# EAGLE design T17_Schematic_The_Useless_Box (EAGLE 7.1.0)
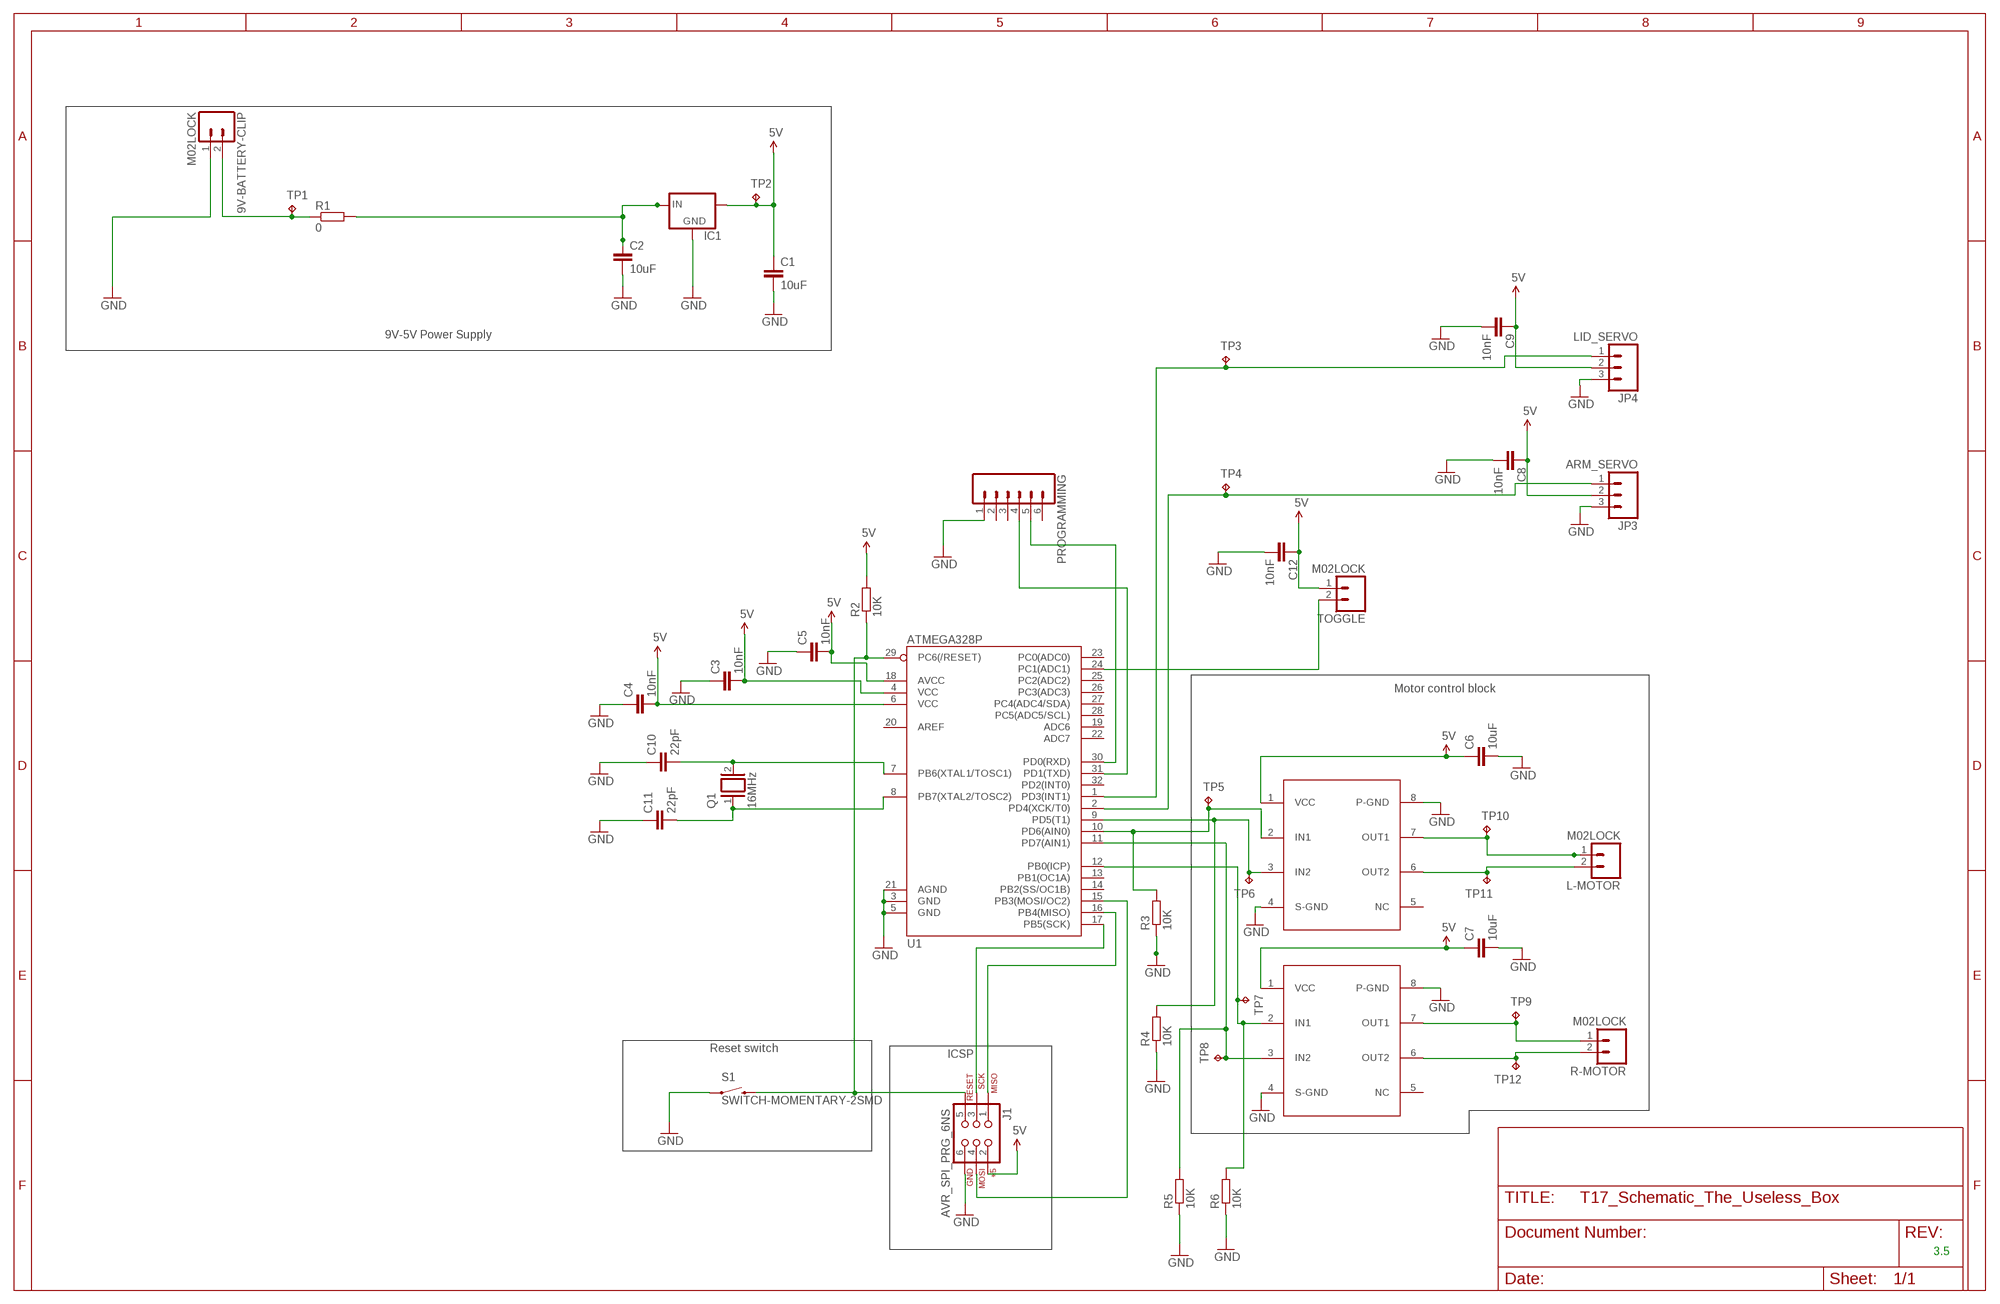
[diagram p0: schematic, sheet 1]

## Parts
9V-BATTERY-CLIP  M02LOCK  [1X02_LOCK]
C1  10uF  C-EUC0805  [C0805]
C2  10uF  C-EUC0805  [C0805]
C3  10nF  C-EUC0805  [C0805]
C4  10nF  C-EUC0805  [C0805]
C5  10nF  C-EUC0805  [C0805]
C6  10uF  C-EUC0805  [C0805]
C7  10uF  C-EUC0805  [C0805]
C8  10nF  C-EUC0805  [C0805]
C9  10nF  C-EUC0805  [C0805]
C10  22pF  C-EUC0805  [C0805]
C11  22pF  C-EUC0805  [C0805]
C12  10nF  C-EUC0805  [C0805]
IC1  V_REG_78XX-TO-220  [TO-220-ALT]
J1  AVR_SPI_PRG_6NS  [2X3-NS]
JP3  ARM_SERVO  M03PTH  [1X03]
JP4  LID_SERVO  M03PTH  [1X03]
L-MOTOR  M02LOCK  [1X02_LOCK]
PROGRAMMING  M06NO_SILK_FEMALE_PTH  [1X06_NO_SILK]
Q1  16MHz  XTAL/S  [QS]
R1  0  R-EU_R0805  [R0805]
R2  10K  R-EU_R0805  [R0805]
R3  10K  R-EU_R0805  [R0805]
R4  10K  R-EU_R0805  [R0805]
R5  10K  R-EU_R0805  [R0805]
R6  10K  R-EU_R0805  [R0805]
R-MOTOR  M02LOCK  [1X02_LOCK]
S1  SWITCH-MOMENTARY-2SMD  [TACTILE-SWITCH-SMD]
TOGGLE  M02LOCK  [1X02_LOCK]
TP1  TPB1,27  [B1,27]
TP2  TPB1,27  [B1,27]
TP3  TPB1,27  [B1,27]
TP4  TPB1,27  [B1,27]
TP5  TPB1,27  [B1,27]
TP6  TPB1,27  [B1,27]
TP7  TPB1,27  [B1,27]
TP8  TPB1,27  [B1,27]
TP9  TPB1,27  [B1,27]
TP10  TPB1,27  [B1,27]
TP11  TPB1,27  [B1,27]
TP12  TPB1,27  [B1,27]
U1  ATMEGA328P  ATMEGA328_SMT  [TQFP32-08]
U$1  LB1938FA-AH  [MSOP8]
U$2  LB1938FA-AH  [MSOP8]

## Nets
5V: C1.1 C3.2 C4.2 C5.2 C6.1 C7.1 C8.1 C9.1 C12.1 IC1.OUT J1.2 JP3.2 JP4.2 R2.2 TOGGLE.1 TP2.TP U1.4(VCC) U1.6(VCC) U1.18(AVCC) U$1.1(VCC) U$2.1(VCC)
GND: 9V-BATTERY-CLIP.1 C1.2 C2.2 C3.1 C4.1 C5.1 C6.2 C7.2 C8.2 C9.2 C10.1 C11.1 C12.2 IC1.GND J1.6 JP3.3 JP4.3 PROGRAMMING.1 R3.1 R4.1 R5.1 R6.1 S1.1 U1.3(GND) U1.5(GND) U1.21(AGND) U$1.4(S-GND) U$1.8(P-GND) U$2.4(S-GND) U$2.8(P-GND)
N$1: R6.2 TP7.TP U1.12(PB0(ICP)) U$1.2(IN1)
N$2: R-MOTOR.1 TP9.TP U$1.7(OUT1)
N$3: R-MOTOR.2 TP12.TP U$1.6(OUT2)
N$4: L-MOTOR.2 TP11.TP U$2.6(OUT2)
N$5: L-MOTOR.1 TP10.TP U$2.7(OUT1)
N$6: R5.2 TP8.TP U1.11(PD7(AIN1)) U$1.3(IN2)
N$7: J1.4 U1.15(PB3(MOSI/OC2))
N$8: JP3.1 TP4.TP U1.2(PD4(XCK/T0))
N$9: PROGRAMMING.5 U1.30(PD0(RXD))
N$10: JP4.1 TP3.TP U1.1(PD3(INT1))
N$11: C2.1 IC1.IN R1.2
N$12: 9V-BATTERY-CLIP.2 R1.1 TP1.TP
N$13: R3.2 TP5.TP U1.10(PD6(AIN0)) U$2.2(IN1)
N$14: J1.3 U1.17(PB5(SCK))
N$15: PROGRAMMING.4 U1.31(PD1(TXD))
N$16: J1.5 R2.1 S1.3 U1.29(PC6(/RESET))
N$17: C11.2 Q1.1 U1.8(PB7(XTAL2/TOSC2))
N$18: J1.1 U1.16(PB4(MISO))
N$19: C10.2 Q1.2 U1.7(PB6(XTAL1/TOSC1))
N$20: R4.2 TP6.TP U1.9(PD5(T1)) U$2.3(IN2)
N$21: TOGGLE.2 U1.24(PC1(ADC1))
Unconnected: PROGRAMMING.2 PROGRAMMING.3 PROGRAMMING.6 U1.13(PB1(OC1A)) U1.14(PB2(SS/OC1B)) U1.19(ADC6) U1.20(AREF) U1.22(ADC7) U1.23(PC0(ADC0)) U1.25(PC2(ADC2)) U1.26(PC3(ADC3)) U1.27(PC4(ADC4/SDA)) U1.28(PC5(ADC5/SCL)) U1.32(PD2(INT0)) U$1.5(NC) U$2.5(NC)

## Notes on the sheet
- 9V-5V Power Supply
- Motor control block
- Reset switch
- ICSP
- 3.5

## Library data of the parts
9V-BATTERY-CLIP L-MOTOR R-MOTOR TOGGLE = SparkFun-Connectors:M02: Standard 2-pin 0.1" header. Use with - straight break away headers ( PRT-00116) - right angle break away headers (PRT-00553) - swiss pins (PRT-00743) - machine pins (PRT-00117) - female headers (PRT-00115) Molex polarized connector foot print use with: PRT-08233 with associated crimp pins and housings. 2.54_SCREWTERM for use with PRT-10571. 3.5mm Screw Terminal footprints for PRT-08084 5mm Screw Terminal footprints for use with PRT-08432
C1-C12 = rcl:C-EU: CAPACITOR, European symbol
IC1 = SparkFun-PowerIC:V_REG_78XX: Voltage Regulator Standard 7805 5V regulator. IGO (Input Ground Output). Spark Fun Electronics SKU : COM-00107
J1 = SparkFun-Connectors:AVR_SPI_PRG_6: AVR ISP 6 Pin This is the reduced ISP connector for AVR programming. Common on Arduino. This footprint will take up less PCB space and can be used with a 10-pin to 6-pin adapter such as SKU: BOB-08508 **Special note about "TEST_POINT" package. The stop mask is on the top side, so if you want your programming test points to be on the bottom of your board, make sure to place this package on the bottom side of the board. This also ensure that the orientation to program from the bottom side will be correct.
JP3 JP4 = SparkFun-Connectors:M03: Header 3 Standard 3-pin 0.1" header. Use with straight break away headers (SKU : PRT-00116), right angle break away headers (PRT-00553), swiss pins (PRT-00743), machine pins (PRT-00117), and female headers (PRT-00115). Molex polarized connector foot print use with SKU : PRT-08232 with associated crimp pins and housings.
PROGRAMMING = SparkFun-Connectors:M06: Header 6 Standard 6-pin 0.1" header. Use with straight break away headers (SKU : PRT-00116), right angle break away headers (PRT-00553), swiss pins (PRT-00743), machine pins (PRT-00117), and female headers (PRT-00115). Molex polarized connector foot print use with SKU : PRT-08094 with associated crimp pins and housings. NOTES ON THE VARIANTS LOCK and LOCK_LONGPADS... This footprint was designed to help hold the alignment of a through-hole component (i.e. 6-pin header) while soldering it into place. You may notice that each hole has been shifted either up or down by 0.005 of an inch from it's more standard position (which is a perfectly straight line). This slight alteration caused the pins (the squares in the middle) to touch the edges of the holes. Because they are alternating, it causes a "brace" to hold the component in place. 0.005 has proven to be the perfect amount of "off-center" position when using our standard breakaway headers. Although looks a little odd when you look at the bare footprint, once you have a header in there, the alteration is very hard to notice. Also,if you push a header all the way into place, it is covered up entirely on the bottom side. This idea of altering the position of holes to aid alignment will be further integrated into the Sparkfun Library for other footprints. It can help hold any component with 3 or more connection pins.; PROD_ID: CONN-08437
Q1 = special:XTAL/S: CRYSTAL
R1-R6 = rcl:R-EU_: RESISTOR, European symbol
S1 = SparkFun-Electromechanical:SWITCH-MOMENTARY-2: Various NO switches- pushbuttons, reed, etc; PROD_ID: SWCH-08247
TP1-TP12 = testpad:TP: Test pad
U1 = SparkFun-DigitalIC:ATMEGA328_SMT: 32-Pin Atmega328 part Commonly used on Arduino compatible boards Available in QFP and QFN packages TQFP is IC-09069 QFN is non-stock; PROD_ID: IC-09069
U$1 U$2 = microchip-MCP125x-xxx:LB1938FA-AH

## Board
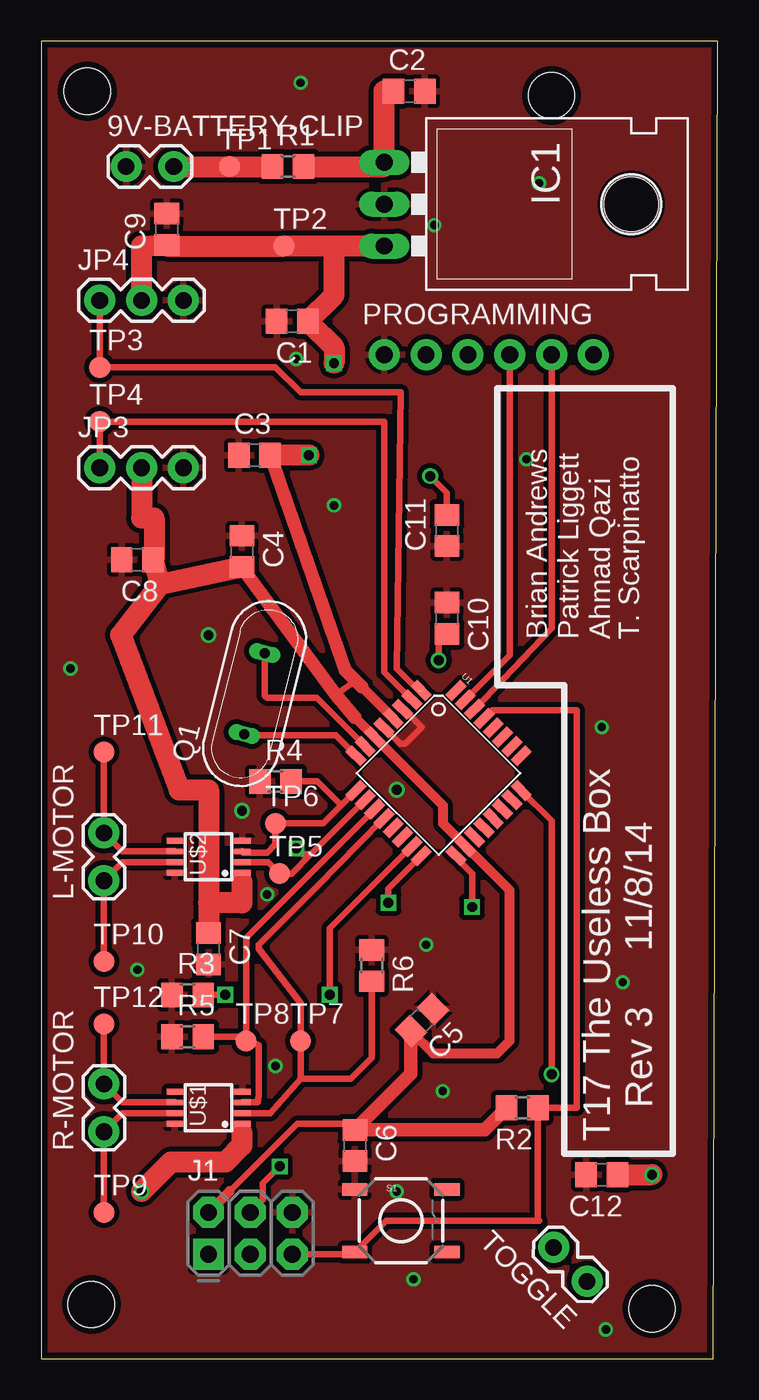
[diagram p1: board, top side]
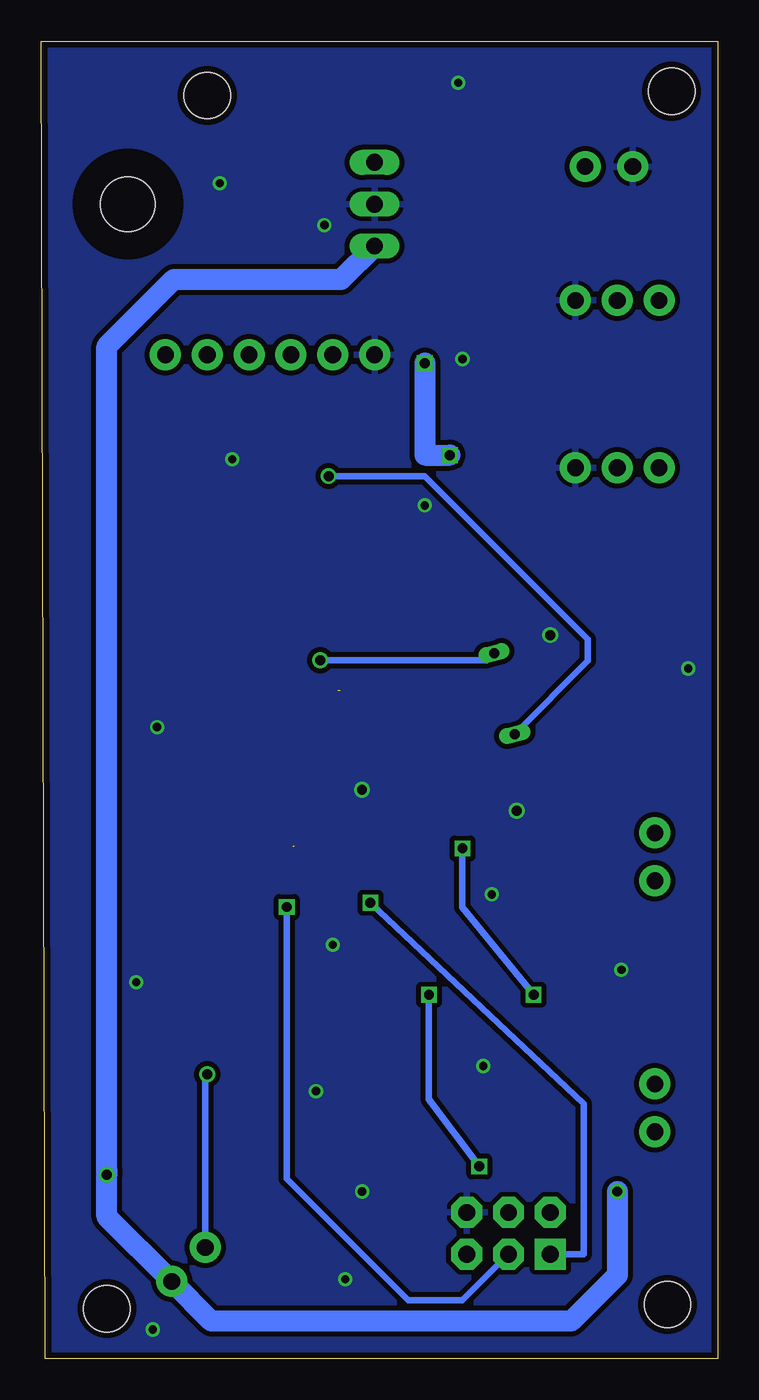
[diagram p2: board, bottom side, seen from below]

Size 41.07 x 80 mm. Coordinates in mm from the lower left corner, seen from the top.
Outline: 0,0 40.82,0 41.07,80 0,80 0,0
Copper layers (1*16): Top 0.0356mm / dielectric 1.5011mm / Bottom 0.0356mm
Design rules "OSH-Park-2-layer": minimum track width 6mil, minimum drill 13mil, track to track 6mil, track to pad 6mil, pad to pad 6mil, via to via 6mil, smd to smd 6mil, copper to edge 15mil, drill to drill 6mil, minimum pad ring 7mil, minimum via ring 7mil, stop-mask expansion 3mil, vias tented up to drill 0mil, thermal gap 10mil
Holes 2.8 mm at 2.79,76.96 30.99,76.71 37.08,3.05 3.05,3.3

### Footprints (pad centres in the part's own frame; a part is rotated, then mirrored left to right if it is on the bottom)
1X02_LOCK = drill 1.016 pad 1.88: 1 -0.178,0; 2 2.718,0
C0805 = smd 1.3 x 1.5: 1 -0.95,0; 2 0.95,0
TO-220-ALT = drill 1.016 long: GND 0,-3.81; IN -2.54,-3.81; OUT 2.54,-3.81 | hole 3.302: 0,11.176
2X3-NS = drill 1.016 pad 1.88 square: 1 -2.54,-1.27 | drill 1.016 pad 1.88 octagon: 2 -2.54,1.27; 3 0,-1.27; 4 0,1.27; 5 2.54,-1.27; 6 2.54,1.27
1X03 = drill 1.016 pad 1.88: 1 0,0; 2 2.54,0; 3 5.08,0
1X06_NO_SILK = drill 1.016 pad 1.88: 1 0,0; 2 2.54,0; 3 5.08,0; 4 7.62,0; 5 10.16,0; 6 12.7,0
QS = drill 0.61 long: 1 -2.54,0; 2 2.54,0
R0805 = smd 1.3 x 1.5: 1 -0.95,0; 2 0.95,0
TACTILE-SWITCH-SMD = smd 1.524 x 0.762: 1 -2.794,1.905; 2 2.794,1.905; 3 -2.794,-1.905; 4 2.794,-1.905
B1,27 = smd 1.27 x 1.27: TP 0,0
TQFP32-08 = smd 1.27 x 0.559: 1 -4.293,2.8; 2 -4.293,2; 3 -4.293,1.2; 4 -4.293,0.4; 5 -4.293,-0.4; 6 -4.293,-1.2; 7 -4.293,-2; 8 -4.293,-2.8; 17 4.293,-2.8; 18 4.293,-2; 19 4.293,-1.2; 20 4.293,-0.4; 21 4.293,0.4; 22 4.293,1.2; 23 4.293,2; 24 4.293,2.8 | smd 0.559 x 1.27: 9 -2.8,-4.293; 10 -2,-4.293; 11 -1.2,-4.293; 12 -0.4,-4.293; 13 0.4,-4.293; 14 1.2,-4.293; 15 2,-4.293; 16 2.8,-4.293; 25 2.8,4.293; 26 2,4.293; 27 1.2,4.293; 28 0.4,4.293; 29 -0.4,4.293; 30 -1.2,4.293; 31 -2,4.293; 32 -2.8,4.293
MSOP8 = smd 0.35 x 1: 1 -0.975,-2.05; 2 -0.325,-2.05; 3 0.325,-2.05; 4 0.975,-2.05; 5 0.975,2.05; 6 0.325,2.05; 7 -0.325,2.05; 8 -0.975,2.05

### Placement (x,y rotation side)
9V-BATTERY-CLIP  5.33,72.39 0 top
C1  15.24,62.99 180 top
C2  22.35,76.96 0 top
C3  12.95,54.86 0 top
C4  12.19,49.02 270 top
C5  23.11,20.57 225 top
C6  19.05,12.95 270 top
C7  10.16,24.89 270 top
C8  5.84,48.51 180 top
C9  7.62,68.58 90 top
C10  24.64,44.96 270 top
C11  24.64,50.29 90 top
C12  34.04,11.18 180 top
IC1  24.64,70.1 270 top
J1  12.7,7.62 0 top
JP3  3.56,54.1 0 top
JP4  3.56,64.26 0 top
L-MOTOR  3.81,29.21 90 top
PROGRAMMING  20.83,60.96 0 top
Q1  12.95,40.39 75.8 top
R1  14.99,72.39 0 top
R2  29.21,15.24 180 top
R3  8.89,22.1 0 top
R4  14.22,35.05 0 top
R5  8.89,19.56 0 top
R6  20.07,23.88 270 top
R-MOTOR  3.81,13.97 90 top
S1  21.84,8.38 0 top
TOGGLE  33.02,4.83 134.6 top
TP1  11.43,72.39 0 top
TP2  14.73,67.56 0 top
TP3  3.56,60.2 0 top
TP4  3.56,56.9 0 top
TP5  14.48,29.46 0 top
TP6  14.22,32.51 0 top
TP7  15.75,19.3 0 top
TP8  12.45,19.3 0 top
TP9  3.81,8.89 0 top
TP10  3.81,24.13 0 top
TP11  3.81,36.83 0 top
TP12  3.81,20.32 0 top
U1  24.13,35.56 315 top
U$1  10.16,15.24 90 top
U$2  10.16,30.48 90 top

### Tracks (layer width: path | path; a pad name or v marks a point on that pad's centre or on a via)
5V  (via drill 0.6, 0.6 pad 0.25)  (2 unrouted)
  Top 0.406: C6.1 19.05,14.27 15.54,14.27 11.45,10.18 | U1.4 19.05,41.15 17.9,40.31 | U$1.1 12.21,13.73 12.19,13.72 | U$2.1 12.21,28.97 12.19,28.96
  Top 0.61: U1.4 19.46,40.8 | 19.04,38.95 U1.6 24.38,33.61 24.38,32.51 25.75,31.14 | 11.45,10.18 J1.2 | C5.2 23.8,18.54 27.69,18.54 28.45,19.3 28.45,28.45 25.79,31.11
  Top 0.813: 19.46,40.8 18.45,41.8 C3.2 | 19.04,38.95 17.9,40.31 C4.2 | R2.2 26.92,13.9 C6.1 22.44,17.3 C5.2
  Top 1.27: 10.16,27.69 10.16,34.54 8.38,34.54 4.83,43.94 7.19,46.99 | 10.16,27.69 C7.1 | C4.2 7.19,46.99 | 7.19,46.99 C8.1 6.86,48.51 6.86,51.05 6.1,51.05 JP3.2 | IC1.OUT 17.78,67.56 | 17.78,67.56 TP2.TP 7.62,67.56 C9.1 6.1,67.56 JP4.2 | v17.78,60.45 17.78,61.4 C1.1 17.78,64.58 17.78,67.56 | v16.26,54.86 C3.2 | 12.19,13.72 12.19,12.95 11.18,11.94 7.87,11.94 v6.1,10.16 | 12.19,28.96 12.19,27.69 10.16,27.69 | C12.1 v37.08,11.18
  Bottom 1.27: v17.78,60.45 17.78,54.86 v16.26,54.86 | v6.1,10.16 6.1,5.08 8.89,2.29 30.73,2.29 TOGGLE.1 | IC1.OUT 22.86,65.53 33.02,65.53 37.08,61.47 37.08,11.43 v37.08,11.18 37.08,8.64 TOGGLE.1 | TOGGLE.1 | TOGGLE.1
GND  (via drill 0.5, 0.6, 0.6 pad 0.25)
  Top 0.406: U1.5 21.79,37.34 22.1,37.34 23.11,38.35 22.02,39.44 U1.3
  other vias: 34.29,1.78 21.59,10.16 22.61,4.83 24.38,16.26 35.31,22.86 23.37,25.15 5.84,23.62 34.04,38.35 1.78,41.91 17.78,51.82 29.46,54.61 23.88,68.83 30.23,71.37 15.75,77.47 15.49,60.71 12.19,33.27 10.16,43.94 21.59,34.54 14.22,17.78 13.72,28.19
  pour Top (isolate 0.305): 0,80.01 40.89,80.01 40.89,0 0,0
  pour Bottom (isolate 0.305): 0,0 0,80.01 40.89,80.01 40.89,0
N$1
  Top 0.406: U1.12 19.3,31.3 16.76,28.7 13.21,25.15 13.21,24.89 15.75,21.59 TP7.TP 15.75,17.02 | U$1.2 13.9,14.91 15.75,17.02 | R6.2 20.07,18.29 18.8,17.02 15.75,17.02
N$2
  Top 0.406: U$1.7 4.93,14.91 R-MOTOR.1 TP9.TP
N$3
  Top 0.406: U$1.6 4.93,15.56 R-MOTOR.2 TP12.TP
N$4
  Top 0.406: U$2.6 4.93,30.8 L-MOTOR.2 TP11.TP
N$5
  Top 0.406: TP10.TP L-MOTOR.1 4.93,30.16 U$2.7
N$6
  Top 0.406: U1.11 12.45,25.57 TP8.TP | TP8.TP 13.21,19.05 13.21,16 13.14,15.56 U$1.3 | R5.2 12.19,19.56 TP8.TP
N$7  (via drill 0.6)
  Top 0.406: U1.15 17.53,26.13 v17.53,22.1 | v14.48,11.68 13.46,10.67 13.46,9.65 J1.4
  Bottom 0.406: v17.53,22.1 17.53,15.75 v14.48,11.68
N$8
  Top 0.406: U1.2 20.83,41.69 20.83,56.9 TP4.TP JP3.1
N$9
  Top 0.406: U1.30 30.99,44.37 PROGRAMMING.5
N$10  (1 unrouted)
  Top 0.406: 22.93,40.58 21.59,41.91 21.84,58.67 15.75,58.67 14.22,60.2 TP3.TP JP4.1
N$11
  Top 1.27: R1.2 20.83,72.39 IC1.IN 20.83,76.96 C2.1
N$12
  Top 1.27: 9V-BATTERY-CLIP.2 TP1.TP R1.1
N$13  (via drill 0.6)
  Top 0.406: U$2.2 13.79,30.16 TP5.TP 15.21,29.46 16.37,30.62 | U1.10 16.37,30.62 | R3.2 v11.18,22.1 | v15.49,30.99 15.86,30.62 16.37,30.62
  Bottom 0.406: v11.18,22.1 15.49,27.43 v15.49,30.99
N$14  (via drill 0.6)
  Top 0.406: v26.16,27.43 26.16,29.46 25.18,30.44 U1.17
  Bottom 0.406: v26.16,27.43 26.16,10.92 18.8,3.56 15.49,3.56 J1.3
N$15
  Top 0.406: U1.31 28.45,42.71 PROGRAMMING.4
N$16
  Top 0.406: U1.29 27.37,39.37 32.51,39.37 32.51,15.24 R2.1 30.16,8.45 30.23,8.38 20.95,8.38 S1.3 18.92,6.35 J1.5
N$17  (via drill 0.6 pad 0.25)
  Top 0.406: U1.8 17.88,37.85 12.41,37.85 Q1.1 | C11.2 24.64,52.58 v23.62,53.59
  Bottom 0.406: v23.62,53.59 17.78,53.59 7.87,43.69 7.87,42.38 Q1.1
N$18  (via drill 0.6)
  Top 0.406: U1.16 21.08,28.55 v21.08,27.69
  Bottom 0.406: v21.08,27.69 8.13,15.49 8.13,6.35 J1.1
N$19  (via drill 0.6 pad 0.25)
  Top 0.406: U1.7 16.73,40.13 13.72,40.13 13.58,40.27 Q1.2 | C10.2 24.13,43.5 v24.13,42.42
  Bottom 0.406: v24.13,42.42 14.01,42.42 Q1.2
N$20
  Top 0.406: U1.9 18.21,33.6 | 18.21,33.6 17.12,32.51 TP6.TP 14.22,31.24 13.72,30.73 12.28,30.73 U$2.3 | R4.2 16.76,35.05 18.21,33.6
N$21  (via drill 0.6 pad 0.25)
  Top 0.406: U1.24 30.99,32.66 v30.99,17.27
  Bottom 0.406: v30.99,17.27 31.11,17.15 TOGGLE.2

### Text on the board
tPlace: Brian Andrews / Patrick Liggett / Ahmad Qazi | T. Scarpinatto | Rev 3 11/8/14 | T17 The Useless Box